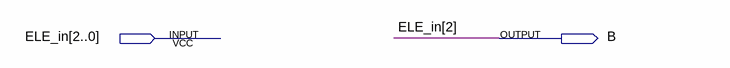
[diagram p0: schematic sheet]
// Quartus schematic DECOD_ELE_B.bdf as structural Verilog: 0 symbols, 2 pins
module DECOD_ELE_B (
  input  [2:0] ELE_in,
  output B
);


  assign B = ELE_in[2];
endmodule
